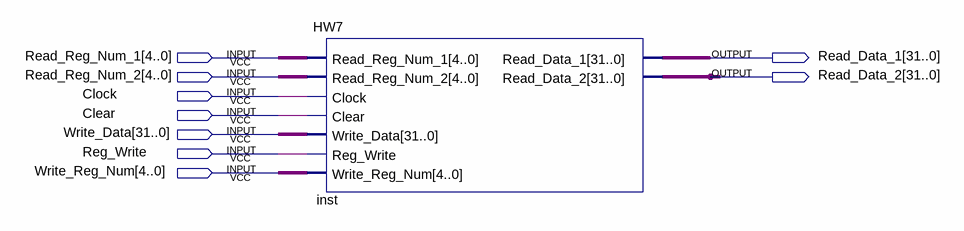
[diagram p0: schematic sheet]
// Quartus schematic HW7_Test.bdf as structural Verilog: 1 symbols, 9 pins
module HW7_Test (
  input  [4:0] Read_Reg_Num_1,
  input  [4:0] Read_Reg_Num_2,
  input  Clock,
  input  Clear,
  input  [31:0] Write_Data,
  input  Reg_Write,
  input  [4:0] Write_Reg_Num,
  output [31:0] Read_Data_1,
  output [31:0] Read_Data_2
);

  HW7 inst (
    .Read_Reg_Num_1(Read_Reg_Num_1), .Read_Reg_Num_2(Read_Reg_Num_2), .Clock(Clock), .Clear(Clear),
    .Write_Data(Write_Data), .Reg_Write(Reg_Write), .Write_Reg_Num(Write_Reg_Num), .Read_Data_1(Read_Data_1),
    .Read_Data_2(Read_Data_2));
endmodule
